# EAGLE schematic SmartWatch-V0.1 (EAGLE 7.2.0)
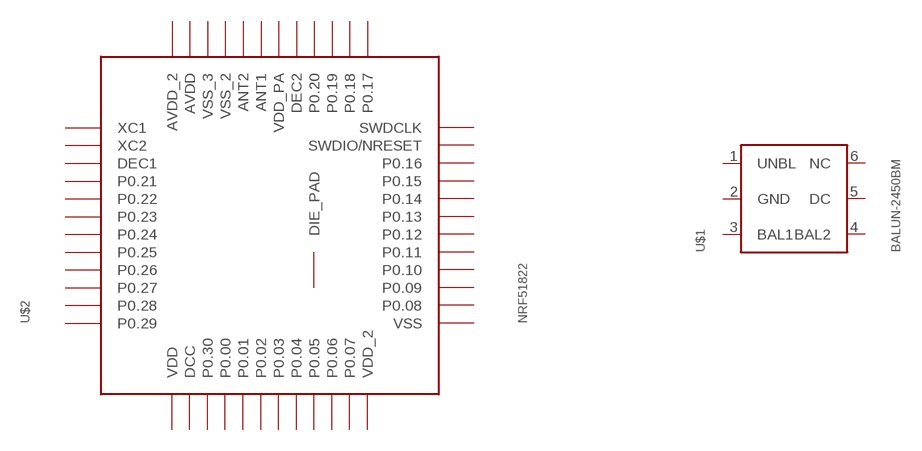
[diagram p0: schematic, sheet 1]

## Parts
U$1  BALUN-2450BM  [2450BM14A0002]
U$2  NRF51822  [QFN48]
Unconnected: U$1.1(UNBL) U$1.2(GND) U$1.3(BAL1) U$1.4(BAL2) U$1.5(DC) U$1.6(NC) U$2.1(VDD) U$2.2(DCC) U$2.3(P0.30) U$2.4(P0.00) U$2.5(P0.01) U$2.6(P0.02) U$2.7(P0.03) U$2.8(P0.04) U$2.9(P0.05) U$2.10(P0.06) U$2.11(P0.07) U$2.12(VDD_2) U$2.13(VSS) U$2.14(P0.08) U$2.15(P0.09) U$2.16(P0.10) U$2.17(P0.11) U$2.18(P0.12) U$2.19(P0.13) U$2.20(P0.14) U$2.21(P0.15) U$2.22(P0.16) U$2.23(SWDIO/NRESET) U$2.24(SWDCLK) U$2.25(P0.17) U$2.26(P0.18) U$2.27(P0.19) U$2.28(P0.20) U$2.29(DEC2) U$2.30(VDD_PA) U$2.31(ANT1) U$2.32(ANT2) U$2.33(VSS_2) U$2.34(VSS_3) U$2.35(AVDD) U$2.36(AVDD_2) U$2.37(XC1) U$2.38(XC2) U$2.39(DEC1) U$2.40(P0.21) U$2.41(P0.22) U$2.42(P0.23) U$2.43(P0.24) U$2.44(P0.25) U$2.45(P0.26) U$2.46(P0.27) U$2.47(P0.28) U$2.48(P0.29) U$2.GND(DIE_PAD)

## Library data of the parts
U$1 = NordicSemi:BALUN-2450BM: General Specifications: Part Number 2450BM14A0002 Insertion Loss 2.0 dB max. Frequency (MHz) 2400 - 2500 Return Loss 9.5 dB min. Unbalanced Impedance 50 Ω Phase Difference 160° ± 15° Amplitude Difference 3.5 ± 1.5 dB Reel Quanity 4,000 Operating Temperature -40 to +85°C Attenuation: Common Mode 2.45 GHz Impedance Matched Balun-Filter: Optimized for Nordic's Chipset nRF24L01/+ Differential Balanced Impedance Conjugate match to Nordic nRF24L01/nRF24L01+ Attenuation: Differential Mode 15 min.@4800~5000MHz 15 min.@7200~7500MHz
U$2 = NordicSemi:NRF51822: Bluetooth 4.0 Low Energy/2.4Ghz NORDIC SEMICONDUCTOR